# EAGLE schematic 1906152157-Dev Board (EAGLE 9.4.0)
DRAFTER: David Antaki; REV: 1; STATUS: ISSUED FOR REVIEW

## Sheet 1 of 2
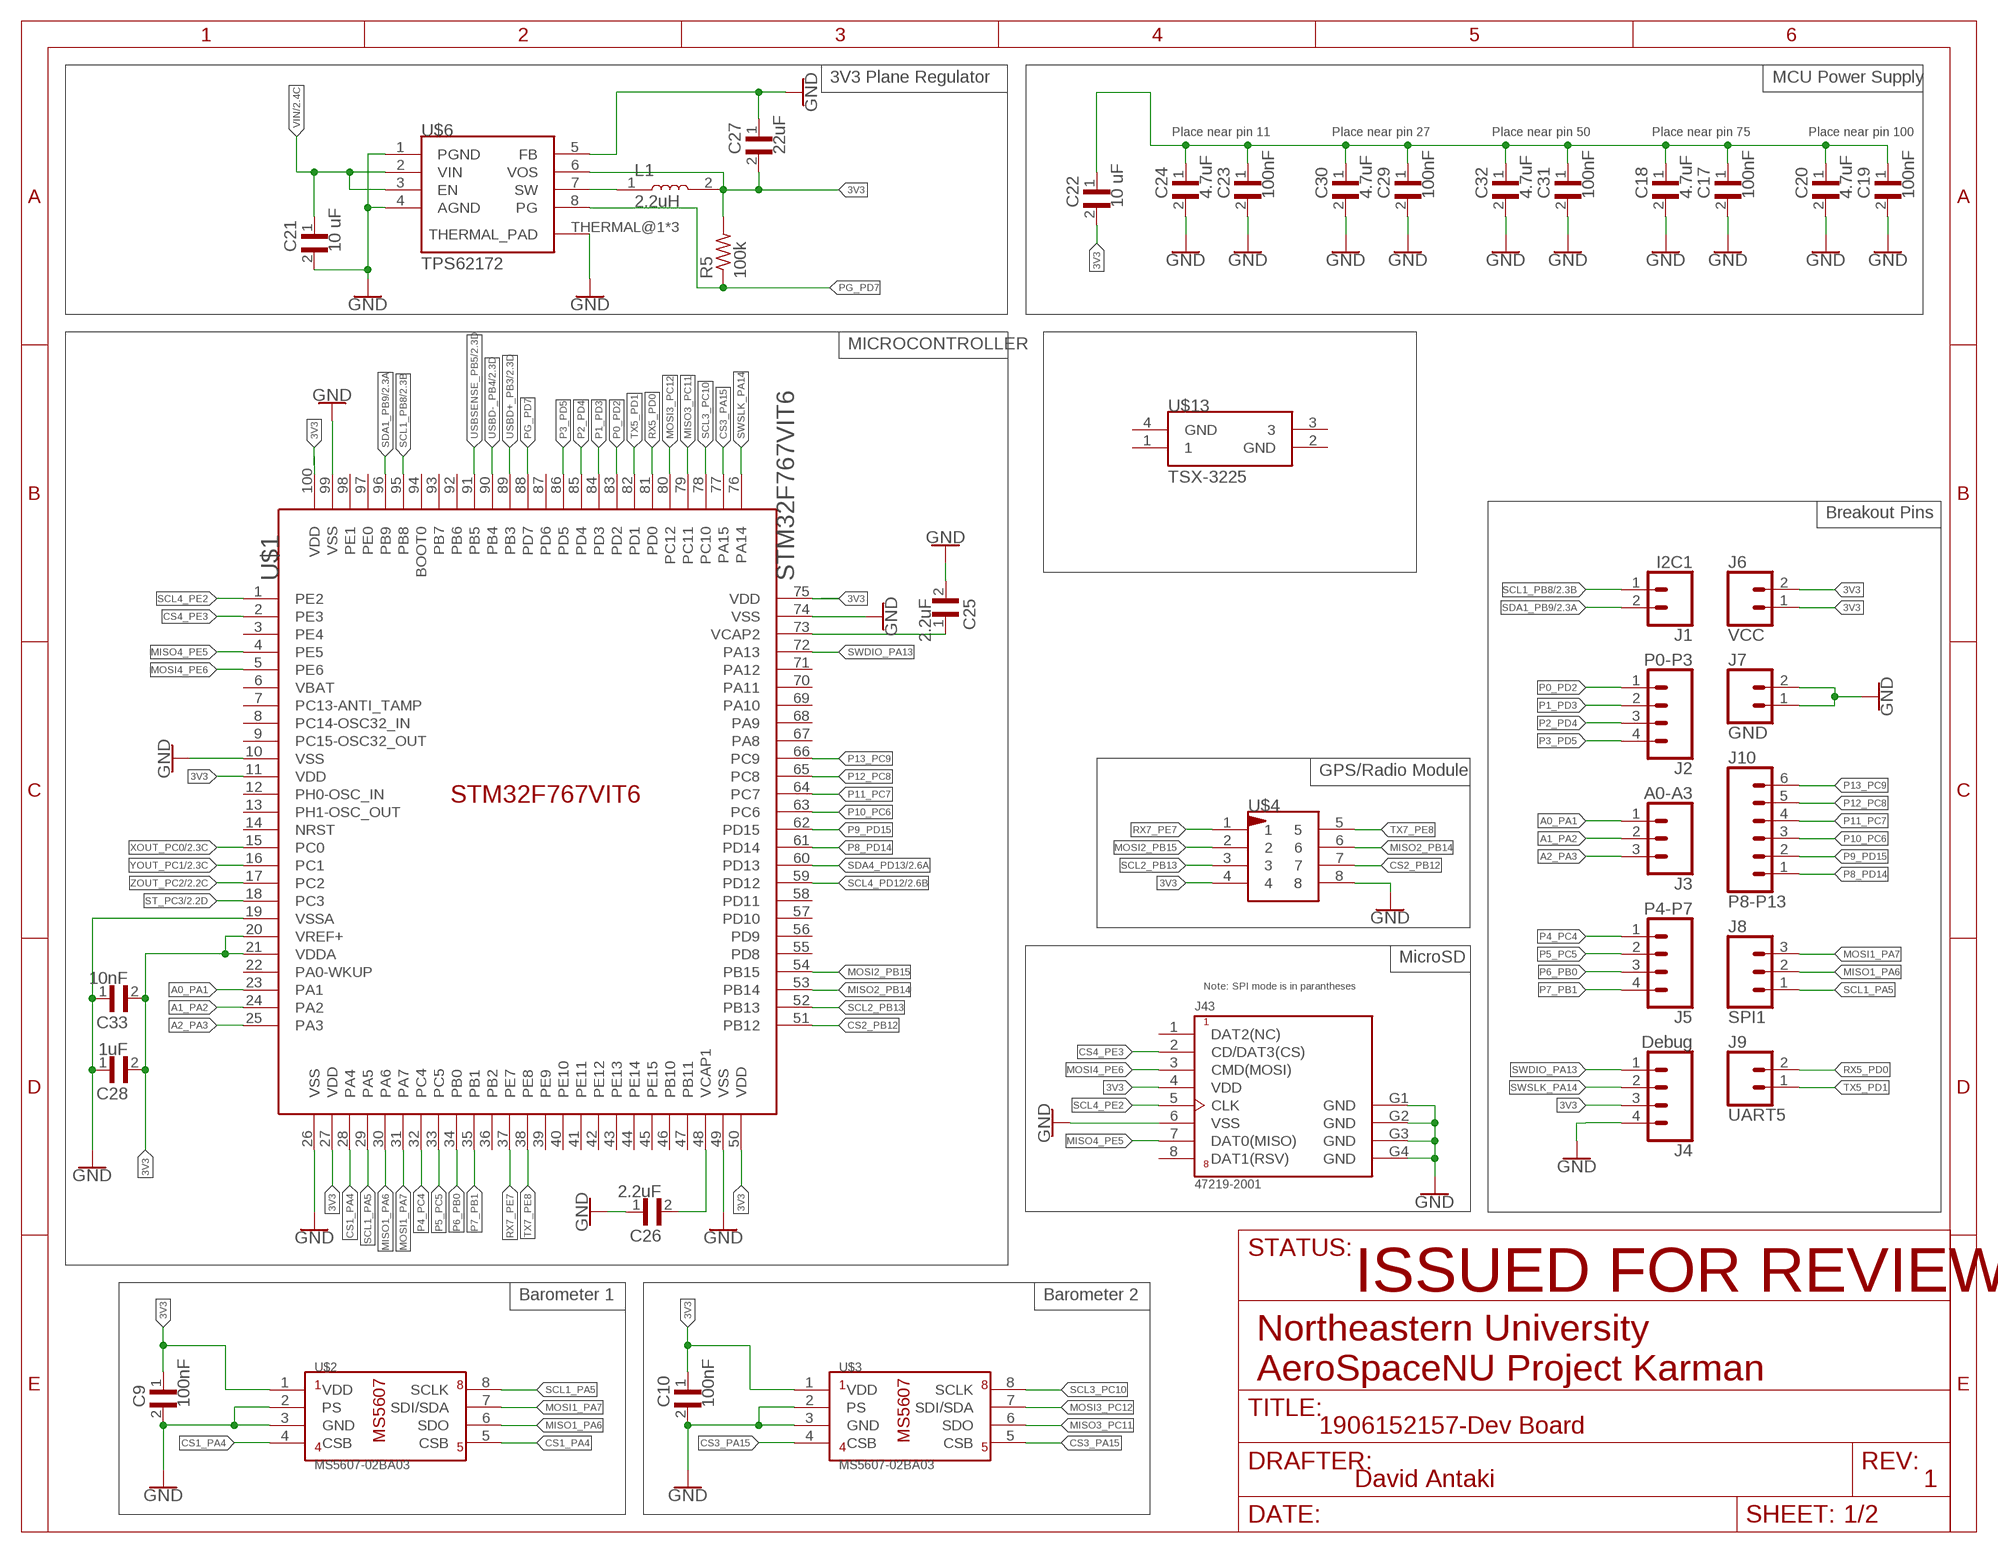
[diagram p0: schematic, sheet 1]

### Parts
C9  100nF  CGA3E2X7R1H104K080AD  [CAPC1608X95N]
C10  100nF  CGA3E2X7R1H104K080AD  [CAPC1608X95N]
C17  100nF  CGA3E2X7R1H104K080AD  [CAPC1608X95N]
C18  4.7uF  CGA3E2X7R1H104K080AD  [CAPC1608X95N]
C19  100nF  CGA3E2X7R1H104K080AD  [CAPC1608X95N]
C20  4.7uF  CGA3E2X7R1H104K080AD  [CAPC1608X95N]
C21  10 uF  CGA3E2X7R1H104K080AD  [CAPC1608X95N]
C22  10 uF  CGA3E2X7R1H104K080AD  [CAPC1608X95N]
C23  100nF  CGA3E2X7R1H104K080AD  [CAPC1608X95N]
C24  4.7uF  CGA3E2X7R1H104K080AD  [CAPC1608X95N]
C25  2.2uF  CGA3E2X7R1H104K080AD  [CAPC1608X95N]
C26  2.2uF  CGA3E2X7R1H104K080AD  [CAPC1608X95N]
C27  22uF  CGA3E2X7R1H104K080AD  [CAPC1608X95N]
C28  1uF  CGA3E2X7R1H104K080AD  [CAPC1608X95N]
C29  100nF  CGA3E2X7R1H104K080AD  [CAPC1608X95N]
C30  4.7uF  CGA3E2X7R1H104K080AD  [CAPC1608X95N]
C31  100nF  CGA3E2X7R1H104K080AD  [CAPC1608X95N]
C32  4.7uF  CGA3E2X7R1H104K080AD  [CAPC1608X95N]
C33  10nF  CGA3E2X7R1H104K080AD  [CAPC1608X95N]
J1  I2C1  CONN_02  [1X02]
J2  P0-P3  CONN_04  [1X04]
J3  A0-A3  CONN_03  [1X03]
J4  Debug  CONN_04  [1X04]
J5  P4-P7  CONN_04  [1X04]
J6  VCC  CONN_02  [1X02]
J7  GND  CONN_02  [1X02]
J8  SPI1  CONN_03  [1X03]
J9  UART5  CONN_02  [1X02]
J10  P8-P13  CONN_06LOCK  [1X06_LOCK]
J43  47219-2001  [MOLEX_47219-2001]
L1  2.2uH  MLF1608E100J  [INDC1608X95N]
R5  100k  CRGH0603F221K  [RESC1608X50N]
U$1  STM32F767VIT6  [LQFP100_14X14]
U$2  MS5607-02BA03  [TE_MS860702BA01-50]
U$3  MS5607-02BA03  [TE_MS860702BA01-50]
U$4  087831-0819  [87831-0819]
U$6  TPS62172  [TPS62172]
U$13  TSX-3225  [TSX-3225]

### Nets
3V3: C9.1 C10.1 C22.2 C27.2 C28.2 C33.2 J4.3 J6.1 J6.2 J43.4(VDD) L1.2 R5.2 U$1.11(VDD) U$1.20(VREF+) U$1.21(VDDA) U$1.27(VDD) U$1.50(VDD) U$1.75(VDD) U$1.100(VDD) U$2.1(VDD) U$3.1(VDD) U$4.4 U$6.6(VOS)
A0_PA1: J3.1 U$1.23(PA1)
A1_PA2: J3.2 U$1.24(PA2)
A2_PA3: J3.3 U$1.25(PA3)
CS1_PA4: U$1.28(PA4) U$2.4(CSB) U$2.5(CSB)
CS2_PB12: U$1.51(PB12) U$4.7
CS3_PA15: U$1.77(PA15) U$3.4(CSB) U$3.5(CSB)
CS4_PE3: J43.2(CD/DAT3(CS)) U$1.2(PE3)
GND: C9.2 C10.2 C17.2 C18.2 C19.2 C20.2 C21.2 C23.2 C24.2 C25.2 C26.1 C27.1 C28.1 C29.2 C30.2 C31.2 C32.2 C33.1 J4.4 J7.1 J7.2 J43.6(VSS) J43.G1(GND) J43.G2(GND) J43.G3(GND) J43.G4(GND) U$1.10(VSS) U$1.19(VSSA) U$1.26(VSS) U$1.49(VSS) U$1.74(VSS) U$1.99(VSS) U$2.2(PS) U$2.3(GND) U$3.2(PS) U$3.3(GND) U$4.8 U$6.1(PGND) U$6.4(AGND) U$6.5(FB) U$6.THERMAL@1(THERMAL_PAD) U$6.THERMAL@2(THERMAL_PAD) U$6.THERMAL@3(THERMAL_PAD) ; also sheet 2
MISO1_PA6: J8.2 U$1.30(PA6) U$2.6(SDO)
MISO2_PB14: U$1.53(PB14) U$4.6
MISO3_PC11: U$1.79(PC11) U$3.6(SDO)
MISO4_PE5: J43.7(DAT0(MISO)) U$1.4(PE5)
MOSI1_PA7: J8.3 U$1.31(PA7) U$2.7(SDI/SDA)
MOSI2_PB15: U$1.54(PB15) U$4.2
MOSI3_PC12: U$1.80(PC12) U$3.7(SDI/SDA)
MOSI4_PE6: J43.3(CMD(MOSI)) U$1.5(PE6)
N$4: C25.1 U$1.73(VCAP2)
N$7: C26.2 U$1.48(VCAP1)
N$8: L1.1 U$6.7(SW)
N$10: C17.1 C18.1 C19.1 C20.1 C22.1 C23.1 C24.1 C29.1 C30.1 C31.1 C32.1
P0_PD2: J2.1 U$1.83(PD2)
P1_PD3: J2.2 U$1.84(PD3)
P2_PD4: J2.3 U$1.85(PD4)
P3_PD5: J2.4 U$1.86(PD5)
P4_PC4: J5.1 U$1.32(PC4)
P5_PC5: J5.2 U$1.33(PC5)
P6_PB0: J5.3 U$1.34(PB0)
P7_PB1: J5.4 U$1.35(PB1)
P8_PD14: J10.1 U$1.61(PD14)
P9_PD15: J10.2 U$1.62(PD15)
P10_PC6: J10.3 U$1.63(PC6)
P11_PC7: J10.4 U$1.64(PC7)
P12_PC8: J10.5 U$1.65(PC8)
P13_PC9: J10.6 U$1.66(PC9)
PG_PD7: R5.1 U$1.88(PD7) U$6.8(PG)
RX5_PD0: J9.2 U$1.81(PD0)
RX7_PE7: U$1.37(PE7) U$4.1
SCL1_PA5: J8.1 U$1.29(PA5) U$2.8(SCLK)
SCL1_PB8: J1.1 U$1.95(PB8) ; also sheet 2
SCL2_PB13: U$1.52(PB13) U$4.3
SCL3_PC10: U$1.78(PC10) U$3.8(SCLK)
SCL4_PD12: U$1.59(PD12) ; also sheet 2
SCL4_PE2: J43.5(CLK) U$1.1(PE2)
SDA1_PB9: J1.2 U$1.96(PB9) ; also sheet 2
SDA4_PD13: U$1.60(PD13) ; also sheet 2
ST_PC3: U$1.18(PC3) ; also sheet 2
SWDIO_PA13: J4.1 U$1.72(PA13)
SWSLK_PA14: J4.2 U$1.76(PA14)
TX5_PD1: J9.1 U$1.82(PD1)
TX7_PE8: U$1.38(PE8) U$4.5
USBD+_PB3: U$1.89(PB3) ; also sheet 2
USBD-_PB4: U$1.90(PB4) ; also sheet 2
USBSENSE_PB5: U$1.91(PB5) ; also sheet 2
VIN: C21.1 U$6.2(VIN) U$6.3(EN) ; also sheet 2
XOUT_PC0: U$1.15(PC0) ; also sheet 2
YOUT_PC1: U$1.16(PC1) ; also sheet 2
ZOUT_PC2: U$1.17(PC2) ; also sheet 2
Unconnected: J43.1(DAT2(NC)) J43.8(DAT1(RSV)) U$1.3(PE4) U$1.6(VBAT) U$1.7(PC13-ANTI_TAMP) U$1.8(PC14-OSC32_IN) U$1.9(PC15-OSC32_OUT) U$1.12(PH0-OSC_IN) U$1.13(PH1-OSC_OUT) U$1.14(NRST) U$1.22(PA0-WKUP) U$1.36(PB2) U$1.39(PE9) U$1.40(PE10) U$1.41(PE11) U$1.42(PE12) U$1.43(PE13) U$1.44(PE14) U$1.45(PE15) U$1.46(PB10) U$1.47(PB11) U$1.55(PD8) U$1.56(PD9) U$1.57(PD10) U$1.58(PD11) U$1.67(PA8) U$1.68(PA9) U$1.69(PA10) U$1.70(PA11) U$1.71(PA12) U$1.87(PD6) U$1.92(PB6) U$1.93(PB7) U$1.94(BOOT0) U$1.97(PE0) U$1.98(PE1) U$13.1 U$13.2(GND) U$13.3 U$13.4(GND)

### Notes on the sheet
- 3V3 Plane Regulator | MCU Power Supply
- Place near pin 11 | Place near pin 27 | Place near pin 50 | Place near pin 75 | Place near pin 100
- MICROCONTROLLER
- Breakout Pins
- GPS/Radio Module
- MicroSD
- Barometer 1 | Barometer 2

## Sheet 2 of 2
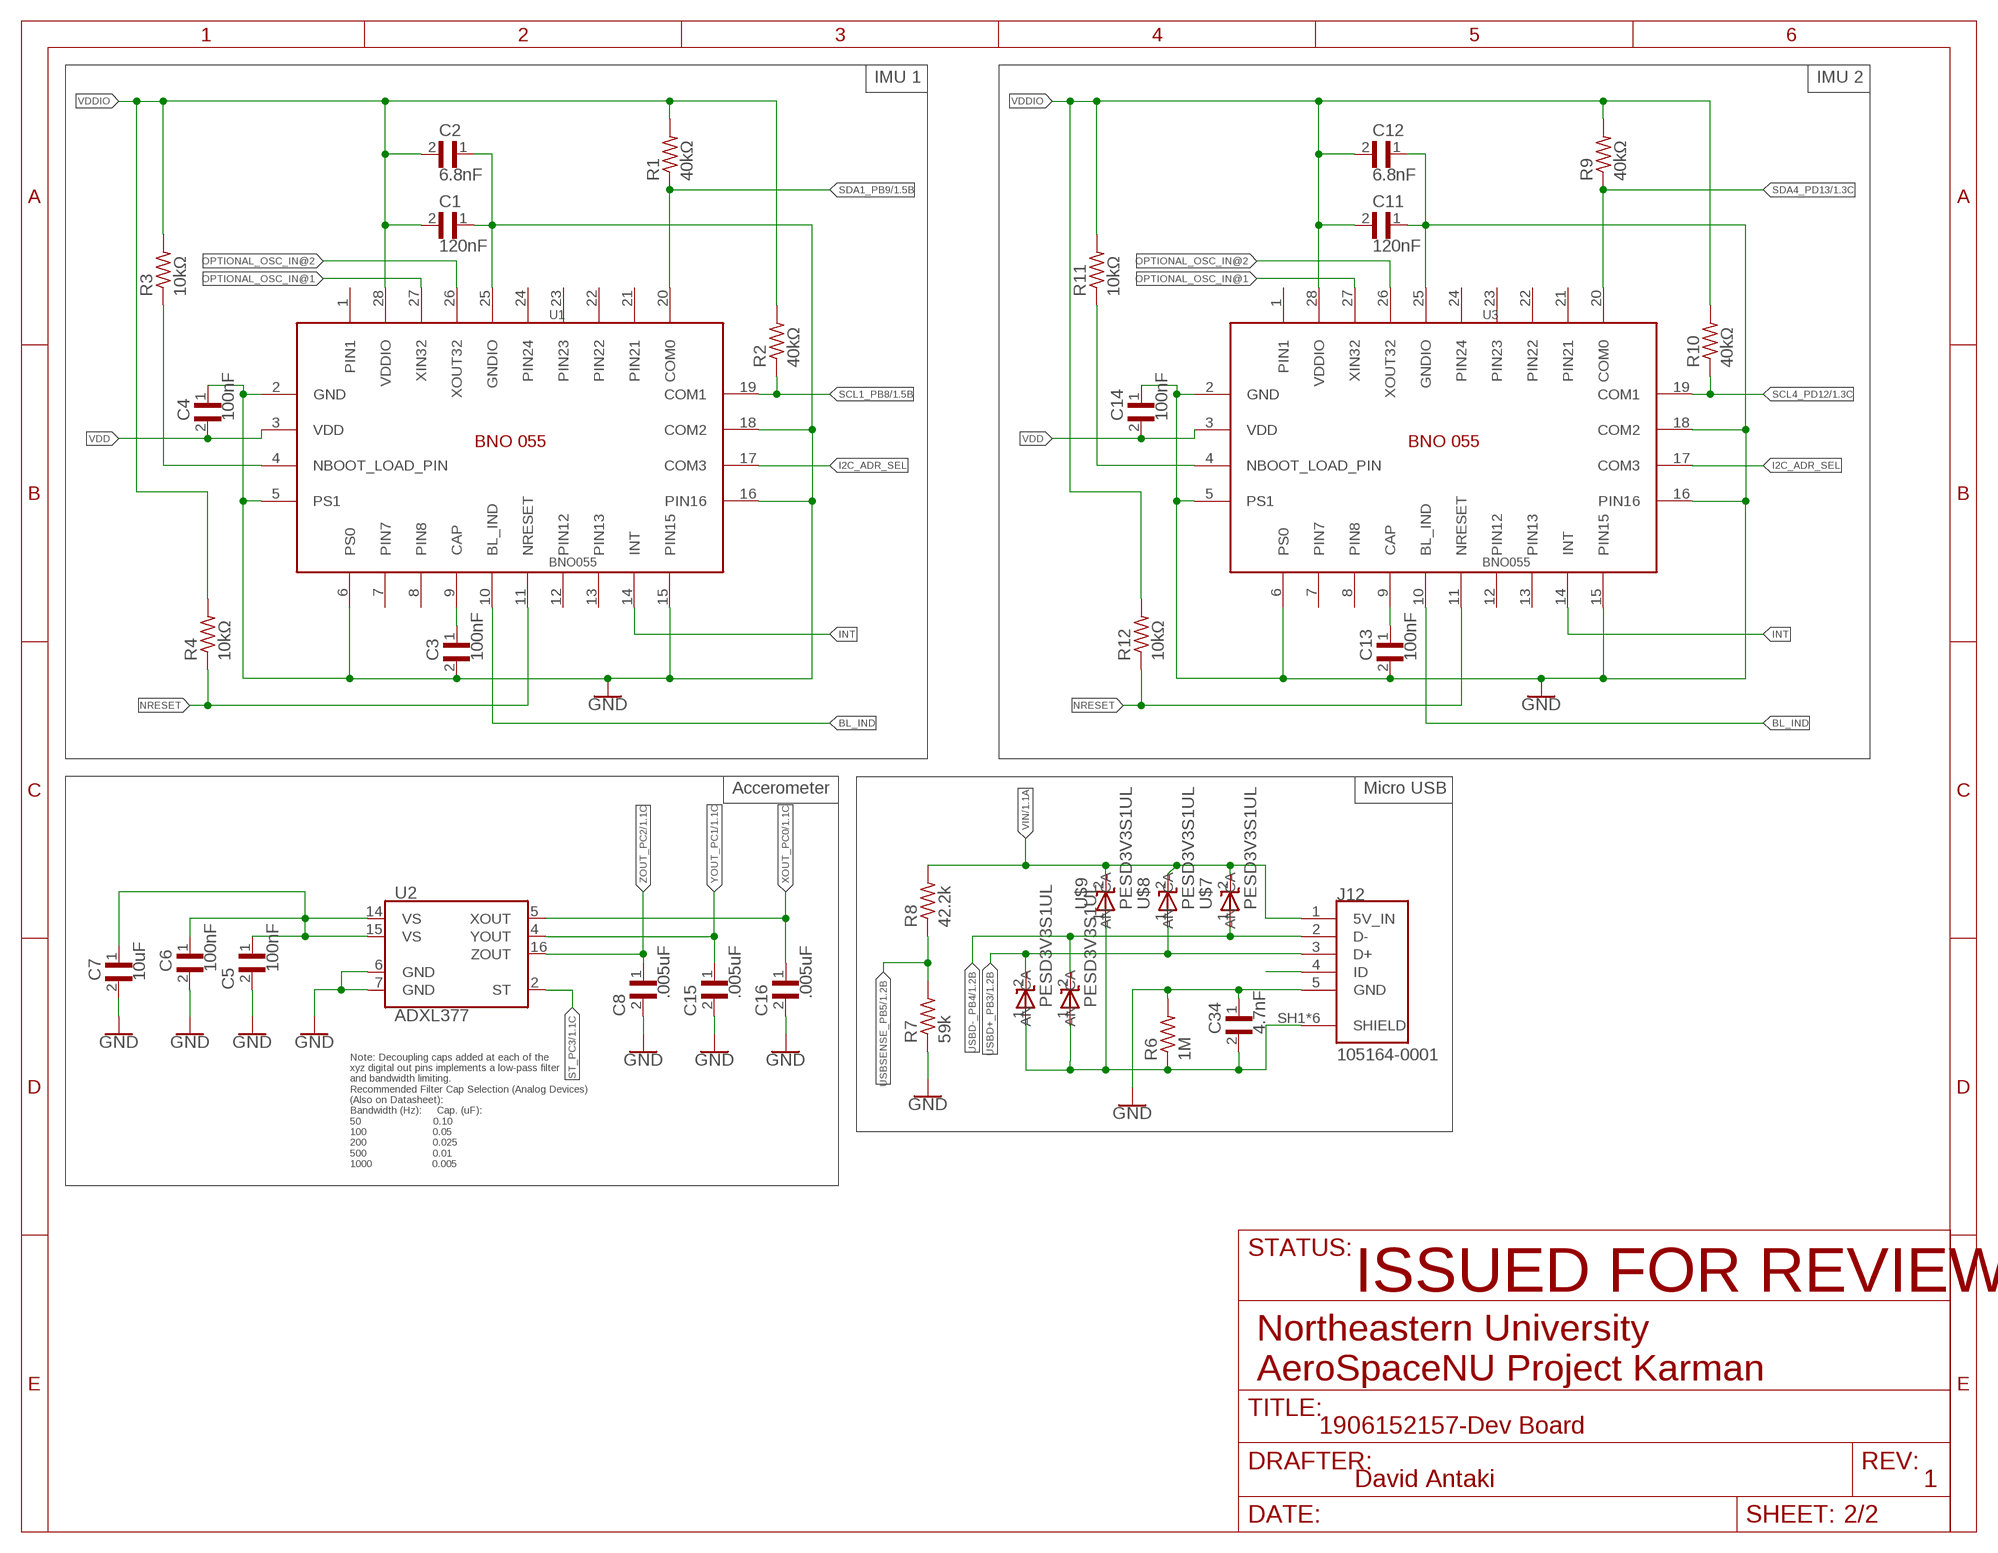
[diagram p1: schematic, sheet 2]

### Parts
C1  120nF  CGA3E2X7R1H104K080AD  [CAPC1608X95N]
C2  6.8nF  CGA3E2X7R1H104K080AD  [CAPC1608X95N]
C3  100nF  CGA3E2X7R1H104K080AD  [CAPC1608X95N]
C4  100nF  CGA3E2X7R1H104K080AD  [CAPC1608X95N]
C5  100nF  CGA3E2X7R1H104K080AD  [CAPC1608X95N]
C6  100nF  CGA3E2X7R1H104K080AD  [CAPC1608X95N]
C7  10uF  CGA3E2X7R1H104K080AD  [CAPC1608X95N]
C8  .005uF  CGA3E2X7R1H104K080AD  [CAPC1608X95N]
C11  120nF  CGA3E2X7R1H104K080AD  [CAPC1608X95N]
C12  6.8nF  CGA3E2X7R1H104K080AD  [CAPC1608X95N]
C13  100nF  CGA3E2X7R1H104K080AD  [CAPC1608X95N]
C14  100nF  CGA3E2X7R1H104K080AD  [CAPC1608X95N]
C15  .005uF  CGA3E2X7R1H104K080AD  [CAPC1608X95N]
C16  .005uF  CGA3E2X7R1H104K080AD  [CAPC1608X95N]
C34  4.7nF  CGA3E2X7R1H104K080AD  [CAPC1608X95N]
J12  105164-0001  [MOLEX_105164-0001]
R1  40kΩ  CRGH0603F221K  [RESC1608X50N]
R2  40kΩ  CRGH0603F221K  [RESC1608X50N]
R3  10kΩ  CRGH0603F221K  [RESC1608X50N]
R4  10kΩ  CRGH0603F221K  [RESC1608X50N]
R6  1M  CRGH0603F221K  [RESC1608X50N]
R7  59k  CRGH0603F221K  [RESC1608X50N]
R8  42.2k  CRGH0603F221K  [RESC1608X50N]
R9  40kΩ  CRGH0603F221K  [RESC1608X50N]
R10  40kΩ  CRGH0603F221K  [RESC1608X50N]
R11  10kΩ  CRGH0603F221K  [RESC1608X50N]
R12  10kΩ  CRGH0603F221K  [RESC1608X50N]
U1  BNO055  [LGA28R50P4X10_380X520X100]
U2  ADXL377  [LFCSP-16-3X3]
U3  BNO055  [LGA28R50P4X10_380X520X100]
U$7  PESD3V3S1UL  [SOD882]
U$8  PESD3V3S1UL  [SOD882]
U$9  PESD3V3S1UL  [SOD882]
U$10  PESD3V3S1UL  [SOD882]
U$11  PESD3V3S1UL  [SOD882]

### Nets
BL_IND: U1.10(BL_IND) U3.10(BL_IND)
GND: C1.1 C2.1 C3.2 C4.1 C5.2 C6.2 C7.2 C8.2 C11.1 C12.1 C13.2 C14.1 C15.2 C16.2 C34.1 J12.5(GND) R6.2 R7.1 U1.2(GND) U1.5(PS1) U1.6(PS0) U1.15(PIN15) U1.16(PIN16) U1.18(COM2) U1.25(GNDIO) U2.6(GND) U2.7(GND) U3.2(GND) U3.5(PS1) U3.6(PS0) U3.15(PIN15) U3.16(PIN16) U3.18(COM2) U3.25(GNDIO) ; also sheet 1
I2C_ADR_SEL: U1.17(COM3) U3.17(COM3)
INT: U1.14(INT) U3.14(INT)
N$1: C3.1 U1.9(CAP)
N$3: R3.1 U1.4(NBOOT_LOAD_PIN)
N$5: C13.1 U3.9(CAP)
N$6: R11.1 U3.4(NBOOT_LOAD_PIN)
N$11: C5.1 C6.1 C7.1 U2.14(VS) U2.15(VS)
N$13: J12.4(ID)
N$14: C34.2 J12.SH1(SHIELD) J12.SH2(SHIELD) J12.SH3(SHIELD) J12.SH4(SHIELD) J12.SH5(SHIELD) J12.SH6(SHIELD) R6.1 U$9.1(CA) U$10.1(CA) U$11.1(CA)
NRESET: R4.1 R12.1 U1.11(NRESET) U3.11(NRESET)
OPTIONAL_OSC_IN@1: U1.27(XIN32) U3.27(XIN32)
OPTIONAL_OSC_IN@2: U1.26(XOUT32) U3.26(XOUT32)
SCL1_PB8: R2.1 U1.19(COM1) ; also sheet 1
SCL4_PD12: R10.1 U3.19(COM1) ; also sheet 1
SDA1_PB9: R1.1 U1.20(COM0) ; also sheet 1
SDA4_PD13: R9.1 U3.20(COM0) ; also sheet 1
ST_PC3: U2.2(ST) ; also sheet 1
USBD+_PB3: J12.3(D+) U$8.1(CA) U$11.2(AN) ; also sheet 1
USBD-_PB4: J12.2(D-) U$7.1(CA) U$10.2(AN) ; also sheet 1
USBSENSE_PB5: R7.2 R8.1 ; also sheet 1
VDD: C4.2 C14.2 U1.3(VDD) U3.3(VDD)
VDDIO: C1.2 C2.2 C11.2 C12.2 R1.2 R2.2 R3.2 R4.2 R9.2 R10.2 R11.2 R12.2 U1.28(VDDIO) U3.28(VDDIO)
VIN: J12.1(5V_IN) R8.2 U$7.2(AN) U$8.2(AN) U$9.2(AN) ; also sheet 1
XOUT_PC0: C16.1 U2.5(XOUT) ; also sheet 1
YOUT_PC1: C15.1 U2.4(YOUT) ; also sheet 1
ZOUT_PC2: C8.1 U2.16(ZOUT) ; also sheet 1
Unconnected: U1.1(PIN1) U1.12(PIN12) U1.13(PIN13) U3.1(PIN1) U3.12(PIN12) U3.13(PIN13)

### Notes on the sheet
- IMU 1 | IMU 2
- Accerometer | Micro USB
- Note: Decoupling caps added at each of the
  xyz digital out pins implements a low-pass filter
  and bandwidth limiting.
  Recommended Filter Cap Selection (Analog Devices)
  (Also on Datasheet):
  Bandwidth (Hz):     Cap. (uF):
  50                        0.10
  100                      0.05
  200                      0.025
  500                      0.01
  1000                    0.005

## Power pins joined to a net without a drawn wire
PIN7: U1.7(PIN7) U3.7(PIN7)
PIN8: U1.8(PIN8) U3.8(PIN8)
PIN21: U1.21(PIN21) U3.21(PIN21)
PIN22: U1.22(PIN22) U3.22(PIN22)
PIN23: U1.23(PIN23) U3.23(PIN23)
PIN24: U1.24(PIN24) U3.24(PIN24)

## Library data of the parts
C1-C34 = CGA3E2X7R1H104K080AD:CGA3E2X7R1H104K080AD: CGA Series 0603 0.1 uF 50 V ±10% X7R SMT Multilayer Ceramic Capacitor; AVAILABILITY: Unavailable; DESCRIPTION: CGA Series 0603 0.1 uF 50 V ±10% X7R SMT Multilayer Ceramic Capacitor; MF: TDK; MP: CGA3E2X7R1H104K080AD; PACKAGE: 0603 TDK; PRICE: None
J1 J6 J7 J9 = SparkFun-Connectors:CONN_02: Multi connection point. Often used as Generic Header-pin footprint for 0.1 inch spaced/style header connections On any of the 0.1 inch spaced packages, you can populate with these: Break Away Headers - Straight <https://www.sparkfun.com/products/116> (PRT-00116) Break Away Male Headers - Right Angle <https://www.sparkfun.com/products/553> (PRT-00553) Female Headers <https://www.sparkfun.com/products/115> (PRT-00115) Break Away Headers - Machine Pin <https://www.sparkfun.com/products/117> (PRT-00117) Break Away Female Headers - Swiss Machine Pin <https://www.sparkfun.com/products/743> (PRT-00743) For SCREWTERMINALS and SPRING TERMINALS visit here: Screw Terimnals on SparkFun.com <https://www.sparkfun.com/search/results?term=Screw+Terminals> (5mm/3.5mm/2.54mm spacing) This device is also useful as a general connection point to wire up your design to another part of your project. Our various solder wires solder well into these plated through hole pads. Hook-Up Wire - Assortment (Stranded, 22 AWG) <https://www.sparkfun.com/products/11375> (PRT-11375) Hook-Up Wire - Assortment (Solid Core, 22 AWG) <https://www.sparkfun.com/products/11367> (PRT-11367) View the entire wire category on our website here <https://www.sparkfun.com/categories/141> Special notes: Molex polarized connector foot print use with: PRT-08233 with associated crimp pins and housings. 2.54_SCREWTERM for use with PRT-10571. 3.5mm Screw Terminal footprints for PRT-08084 5mm Screw Terminal footprints for use with PRT-08432
J2 J4 J5 = SparkFun-Connectors:CONN_04: Multi connection point. Often used as Generic Header-pin footprint for 0.1 inch spaced/style header connections On any of the 0.1 inch spaced packages, you can populate with these: Break Away Headers - Straight <https://www.sparkfun.com/products/116> (PRT-00116) Break Away Male Headers - Right Angle <https://www.sparkfun.com/products/553> (PRT-00553) Female Headers <https://www.sparkfun.com/products/115> (PRT-00115) Break Away Headers - Machine Pin <https://www.sparkfun.com/products/117> (PRT-00117) Break Away Female Headers - Swiss Machine Pin <https://www.sparkfun.com/products/743> (PRT-00743) For SCREWTERMINALS and SPRING TERMINALS visit here: Screw Terimnals on SparkFun.com <https://www.sparkfun.com/search/results?term=Screw+Terminals> (5mm/3.5mm/2.54mm spacing) This device is also useful as a general connection point to wire up your design to another part of your project. Our various solder wires solder well into these plated through hole pads. Hook-Up Wire - Assortment (Stranded, 22 AWG) <https://www.sparkfun.com/products/11375> (PRT-11375) Hook-Up Wire - Assortment (Solid Core, 22 AWG) <https://www.sparkfun.com/products/11367> (PRT-11367) View the entire wire category on our website here <https://www.sparkfun.com/categories/141> Special notes: Molex polarized connector foot print use with SKU : PRT-08231 with associated crimp pins and housings. 1MM SMD Version SKU: PRT-10208; PROD_ID: CONN-09696
J3 J8 = SparkFun-Connectors:CONN_03: Multi connection point. Often used as Generic Header-pin footprint for 0.1 inch spaced/style header connections On any of the 0.1 inch spaced packages, you can populate with these: Break Away Headers - Straight <https://www.sparkfun.com/products/116> (PRT-00116) Break Away Male Headers - Right Angle <https://www.sparkfun.com/products/553> (PRT-00553) Female Headers <https://www.sparkfun.com/products/115> (PRT-00115) Break Away Headers - Machine Pin <https://www.sparkfun.com/products/117> (PRT-00117) Break Away Female Headers - Swiss Machine Pin <https://www.sparkfun.com/products/743> (PRT-00743) Stackable Header - 3 Pin (Female, 0.1") <https://www.sparkfun.com/products/13875> (PRT-13875) For SCREWTERMINALS and SPRING TERMINALS visit here: Screw Terimnals on SparkFun.com <https://www.sparkfun.com/search/results?term=Screw+Terminals> (5mm/3.5mm/2.54mm spacing) This device is also useful as a general connection point to wire up your design to another part of your project. Our various solder wires solder well into these plated through hole pads. Hook-Up Wire - Assortment (Stranded, 22 AWG) <https://www.sparkfun.com/products/11375> (PRT-11375) Hook-Up Wire - Assortment (Solid Core, 22 AWG) <https://www.sparkfun.com/products/11367> (PRT-11367) View the entire wire category on our website here <https://www.sparkfun.com/categories/141> Special notes: Molex polarized connector foot print use with SKU : PRT-08232 with associated crimp pins and housings.
J10 = SparkFun-Connectors:CONN_06: Multi connection point. Often used as Generic Header-pin footprint for 0.1 inch spaced/style header connections On any of the 0.1 inch spaced packages, you can populate with these: Break Away Headers - Straight <https://www.sparkfun.com/products/116> (PRT-00116) Break Away Male Headers - Right Angle <https://www.sparkfun.com/products/553> (PRT-00553) Female Headers <https://www.sparkfun.com/products/115> (PRT-00115) Break Away Headers - Machine Pin <https://www.sparkfun.com/products/117> (PRT-00117) Break Away Female Headers - Swiss Machine Pin <https://www.sparkfun.com/products/743> (PRT-00743) Arduino Stackable Header - 6 Pin <https://www.sparkfun.com/products/9280> (PRT-09280) For SCREWTERMINALS and SPRING TERMINALS visit here: Screw Terimnals on SparkFun.com <https://www.sparkfun.com/search/results?term=Screw+Terminals> (5mm/3.5mm/2.54mm spacing) This device is also useful as a general connection point to wire up your design to another part of your project. Our various solder wires solder well into these plated through hole pads. Hook-Up Wire - Assortment (Stranded, 22 AWG) <https://www.sparkfun.com/products/11375> (PRT-11375) Hook-Up Wire - Assortment (Solid Core, 22 AWG) <https://www.sparkfun.com/products/11367> (PRT-11367) View the entire wire category on our website here <https://www.sparkfun.com/categories/141>
J12 = 105164-0001:105164-0001: Micro-USB B Receptacle without Flange, Top Mount, Surface Mount, Lead-Free; AVAILABILITY: Unavailable; DESCRIPTION: Micro-USB B Receptacle without Flange, Top Mount, Surface Mount, Lead-Free; MF: Molex; MP: 105164-0001; PACKAGE: None; PRICE: None
J43 = 47219-2001:47219-2001: 1.10mm Pitch microSD Card Connector, Hinge Type, Lead-Free http://www.snapeda.com/parts/47219-2001/Molex%20/%20Waldom/view-part/#; AVAILABILITY: Unavailable; DESCRIPTION: Conn Micro SD Card SKT 8 POS 1.1mm Solder RA SMD 0.5A/Contact Embossed T/R; MF: Molex; MP: 47219-2001; PACKAGE: None; PRICE: None
L1 = 0603_Inductor:MLF1608E100J: Ind Shielded Multi-Layer 10uH 5% 2MHz 30Q-Factor Ferrite 10mA 0603; AVAILABILITY: Unavailable; DESCRIPTION: Inductor RF Chip Shielded Multi-Layer 10uH 5% 2MHz 30Q-Factor Ferrite 10mA 1.7Ohm DCR 0603 T/R; MF: TDK; MP: MLF1608E100J; PACKAGE: 0603 TDK; PRICE: None
R1-R4 R9-R12 = CRGH0603F221K:CRGH0603F221K: Res Thick Film 0603 221K Ohm 1% 1/5W ±100ppm/°C Molded SMD SMD T/R; AVAILABILITY: Unavailable; COMMENT: 2-1879507-2; DESCRIPTION: Res Thick Film 0603 221K Ohm 1% 1/5W ±100ppm/°C Molded SMD SMD T/R; MF: TE Connectivity; MP: CRGH0603F221K; PACKAGE: 0603 TE Connectivity; PRICE: None; TE_PURCHASE_URL: https://www.te.com/usa-en/product-2-1879507-2.html?te_bu=Cor&te_type=disp&te_campaign=seda_glo_cor-seda-global-disp-prtnr-fy19-seda-model-bom-cta_sma-317_1&elqCampaignId=32493
R5-R8 = 0603_Resistor:CRGH0603F221K: Res Thick Film 0603 221K Ohm 1% 1/5W ±100ppm/°C Molded SMD SMD T/R; AVAILABILITY: Unavailable; COMMENT: 2-1879507-2; DESCRIPTION: Res Thick Film 0603 221K Ohm 1% 1/5W ±100ppm/°C Molded SMD SMD T/R; MF: TE Connectivity; MP: CRGH0603F221K; PACKAGE: 0603 TE Connectivity; PRICE: None; TE_PURCHASE_URL: https://www.te.com/usa-en/product-2-1879507-2.html?te_bu=Cor&te_type=disp&te_campaign=seda_glo_cor-seda-global-disp-prtnr-fy19-seda-model-bom-cta_sma-317_1&elqCampaignId=32493
U1 U3 = BNO055:BNO055: BNO055 9-axis Absolute Orientation Sensor ( SiP ) w/Sensors and Sensor Fusion; AVAILABILITY: Unavailable; DESCRIPTION: BNO055 9-axis Absolute Orientation Sensor _ SiP _ w/Sensors and Sensor Fusion; MF: Bosch; MP: BNO055; PACKAGE: LGA-28 Bosch; PRICE: None
U2 = ADXL377:ADXL377: Analog Devices ADXL377 Low Power 3-Axis ±200 g Accelerometer with Analog Output The ADXL377 is a small, thin, low power, complete 3-axis accelerometer with signal conditioned voltage outputs. The ADXL377 measures acceleration resulting from motion, shock, or vibration with a typical full-scale range of ±200g. Datasheet <https://cdn.sparkfun.com/datasheets/Sensors/Accelerometers/ADXL377.pdf> SparkFun Products SparkFun Triple Axis Accelerometer Breakout - ADXL377 <https://www.sparkfun.com/products/12803> (SEN-12803); AVAILABILITY: Unavailable; DESCRIPTION: ADI Small, Low Power, 3-Axis +/-3g3x3x1.45mm; MF: Analog Devices; MP: ADXL377; PACKAGE: None; PRICE: None
U$1 = STM32F767VIT6:STM32F767VIT6
U$2 U$3 = MS5607-02BA03:MS5607-02BA03
U$4 = Molex:087831-0819
U$6 = TPS62172:TPS62172
U$7-U$11 = PESD3V3S1UL:PESD3V3S1UL: PESD3V3S1UL Zener Diode Made by David Antaki Digikey <https://www.digikey.com/product-detail/en/nexperia-usa-inc/PESD3V3S1UL315/1727-5353-1-ND/2676832> Datasheet <https://assets.nexperia.com/documents/data-sheet/PESDXS1UL_SER.pdf>
U$13 = TSX-3225 16.0000MF09Z-AC0:TSX-3225